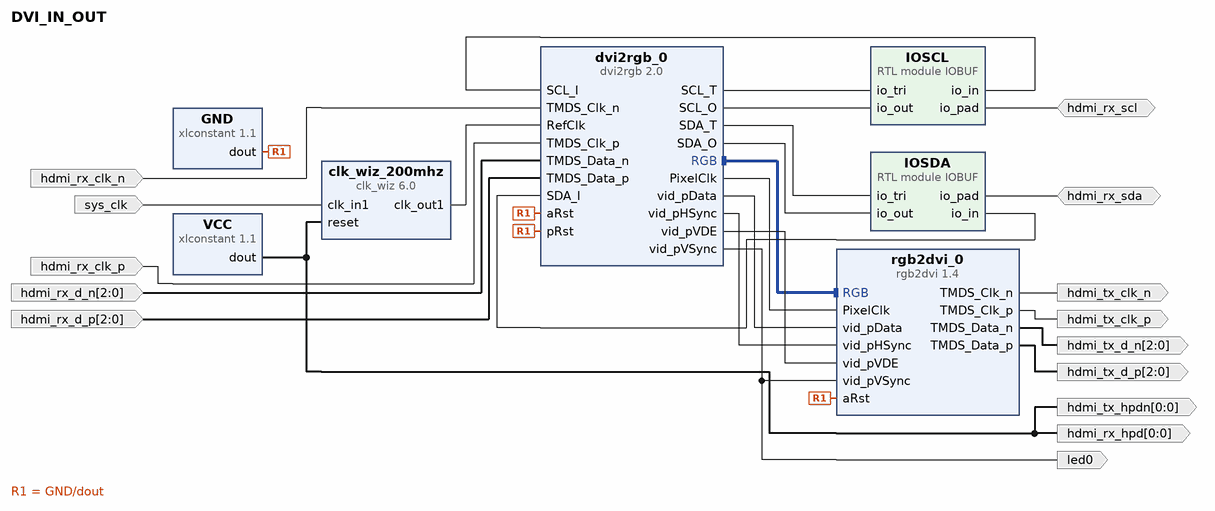
[diagram p0: block diagram of the top level]
# Vivado block design DVI_IN_OUT, xc7z020clg400-1, Vivado 2020.2
create_bd_design DVI_IN_OUT

create_bd_port -dir O -from 0 -to 0 hdmi_rx_hpd
create_bd_port -dir I sys_clk
create_bd_port -dir I hdmi_rx_clk_n
create_bd_port -dir I hdmi_rx_clk_p
create_bd_port -dir O -from 0 -to 0 hdmi_tx_hpdn
create_bd_port -dir O hdmi_tx_clk_p
create_bd_port -dir O hdmi_tx_clk_n
create_bd_port -dir I -from 2 -to 0 hdmi_rx_d_n
create_bd_port -dir O -from 2 -to 0 hdmi_tx_d_n
create_bd_port -dir I -from 2 -to 0 hdmi_rx_d_p
create_bd_port -dir O -from 2 -to 0 hdmi_tx_d_p
create_bd_port -dir O led0
create_bd_port -dir IO hdmi_rx_scl
create_bd_port -dir IO hdmi_rx_sda

create_bd_cell -type ip -vlnv digilentinc.com:ip:dvi2rgb:2.0 dvi2rgb_0
set_property -dict {CONFIG.kClkRange 3 CONFIG.kEnableSerialClkOutput false} [get_bd_cells dvi2rgb_0]
create_bd_cell -type ip -vlnv digilentinc.com:ip:rgb2dvi:1.4 rgb2dvi_0
set_property -dict {CONFIG.kClkPrimitive PLL CONFIG.kClkRange 3 CONFIG.kGenerateSerialClk true} [get_bd_cells rgb2dvi_0]
create_bd_cell -type ip -vlnv xilinx.com:ip:xlconstant:1.1 GND
set_property -dict {CONFIG.CONST_VAL 0 CONFIG.CONST_WIDTH 1} [get_bd_cells GND]
create_bd_cell -type ip -vlnv xilinx.com:ip:clk_wiz:6.0 clk_wiz_200mhz
set_property -dict [list \
  CONFIG.CLKIN1_JITTER_PS 80.0 \
  CONFIG.CLKIN2_JITTER_PS 133.33 \
  CONFIG.CLKOUT1_JITTER 109.241 \
  CONFIG.CLKOUT1_PHASE_ERROR 96.948 \
  CONFIG.CLKOUT1_REQUESTED_OUT_FREQ 200.000 \
  CONFIG.CLK_IN1_BOARD_INTERFACE sys_clock \
  CONFIG.ENABLE_CLOCK_MONITOR false \
  CONFIG.MMCM_CLKFBOUT_MULT_F 8.000 \
  CONFIG.MMCM_CLKIN1_PERIOD 8.000 \
  CONFIG.MMCM_CLKIN2_PERIOD 10.000 \
  CONFIG.MMCM_CLKOUT0_DIVIDE_F 5.000 \
  CONFIG.PRIMITIVE MMCM \
  CONFIG.SECONDARY_SOURCE Single_ended_clock_capable_pin \
  CONFIG.USE_INCLK_SWITCHOVER false \
] [get_bd_cells clk_wiz_200mhz]
create_bd_cell -type ip -vlnv xilinx.com:ip:xlconstant:1.1 VCC
create_bd_cell -type module -reference IOBUF IOSDA
create_bd_cell -type module -reference IOBUF IOSCL

# ---- connections ----

connect_bd_intf_net [get_bd_intf_pins dvi2rgb_0/RGB] [get_bd_intf_pins rgb2dvi_0/RGB]
connect_bd_net [get_bd_pins dvi2rgb_0/PixelClk] [get_bd_pins rgb2dvi_0/PixelClk]
connect_bd_net -net xlconstant_0_dout [get_bd_pins GND/dout] [get_bd_pins dvi2rgb_0/aRst] [get_bd_pins dvi2rgb_0/pRst] [get_bd_pins rgb2dvi_0/aRst]
connect_bd_net [get_bd_pins dvi2rgb_0/vid_pData] [get_bd_pins rgb2dvi_0/vid_pData]
connect_bd_net [get_bd_pins dvi2rgb_0/vid_pHSync] [get_bd_pins rgb2dvi_0/vid_pHSync]
connect_bd_net [get_bd_pins dvi2rgb_0/vid_pVSync] [get_bd_pins rgb2dvi_0/vid_pVSync] [get_bd_ports led0]
connect_bd_net -net dvi2rgb_0_vid_pVDE [get_bd_pins dvi2rgb_0/vid_pVDE] [get_bd_pins rgb2dvi_0/vid_pVDE]
connect_bd_net -net clk_wiz_0_clk_out1 [get_bd_pins clk_wiz_200mhz/clk_out1] [get_bd_pins dvi2rgb_0/RefClk]
connect_bd_net -net xlconstant_1_dout [get_bd_pins VCC/dout] [get_bd_pins clk_wiz_200mhz/reset] [get_bd_ports hdmi_rx_hpd] [get_bd_ports hdmi_tx_hpdn]
connect_bd_net [get_bd_ports sys_clk] [get_bd_pins clk_wiz_200mhz/clk_in1]
connect_bd_net [get_bd_ports hdmi_rx_clk_n] [get_bd_pins dvi2rgb_0/TMDS_Clk_n]
connect_bd_net [get_bd_ports hdmi_rx_clk_p] [get_bd_pins dvi2rgb_0/TMDS_Clk_p]
connect_bd_net [get_bd_pins rgb2dvi_0/TMDS_Clk_p] [get_bd_ports hdmi_tx_clk_p]
connect_bd_net [get_bd_pins rgb2dvi_0/TMDS_Clk_n] [get_bd_ports hdmi_tx_clk_n]
connect_bd_net [get_bd_ports hdmi_rx_d_n] [get_bd_pins dvi2rgb_0/TMDS_Data_n]
connect_bd_net [get_bd_pins rgb2dvi_0/TMDS_Data_n] [get_bd_ports hdmi_tx_d_n]
connect_bd_net [get_bd_ports hdmi_rx_d_p] [get_bd_pins dvi2rgb_0/TMDS_Data_p]
connect_bd_net [get_bd_pins rgb2dvi_0/TMDS_Data_p] [get_bd_ports hdmi_tx_d_p]
connect_bd_net [get_bd_ports hdmi_rx_scl] [get_bd_pins IOSCL/io_pad]
connect_bd_net [get_bd_ports hdmi_rx_sda] [get_bd_pins IOSDA/io_pad]
connect_bd_net [get_bd_pins dvi2rgb_0/SCL_T] [get_bd_pins IOSCL/io_tri]
connect_bd_net [get_bd_pins dvi2rgb_0/SDA_T] [get_bd_pins IOSDA/io_tri]
connect_bd_net [get_bd_pins IOSDA/io_in] [get_bd_pins dvi2rgb_0/SDA_I]
connect_bd_net [get_bd_pins IOSCL/io_in] [get_bd_pins dvi2rgb_0/SCL_I]
connect_bd_net [get_bd_pins dvi2rgb_0/SDA_O] [get_bd_pins IOSDA/io_out]
connect_bd_net [get_bd_pins dvi2rgb_0/SCL_O] [get_bd_pins IOSCL/io_out]
set_property HDL_ATTRIBUTE.DEBUG true [get_bd_nets dvi2rgb_0_vid_pVDE]
set_property HDL_ATTRIBUTE.MARK_DEBUG true [get_bd_nets dvi2rgb_0_vid_pVDE]

validate_bd_design
save_bd_design
